# EAGLE design analogBoard (EAGLE 8.4.3)
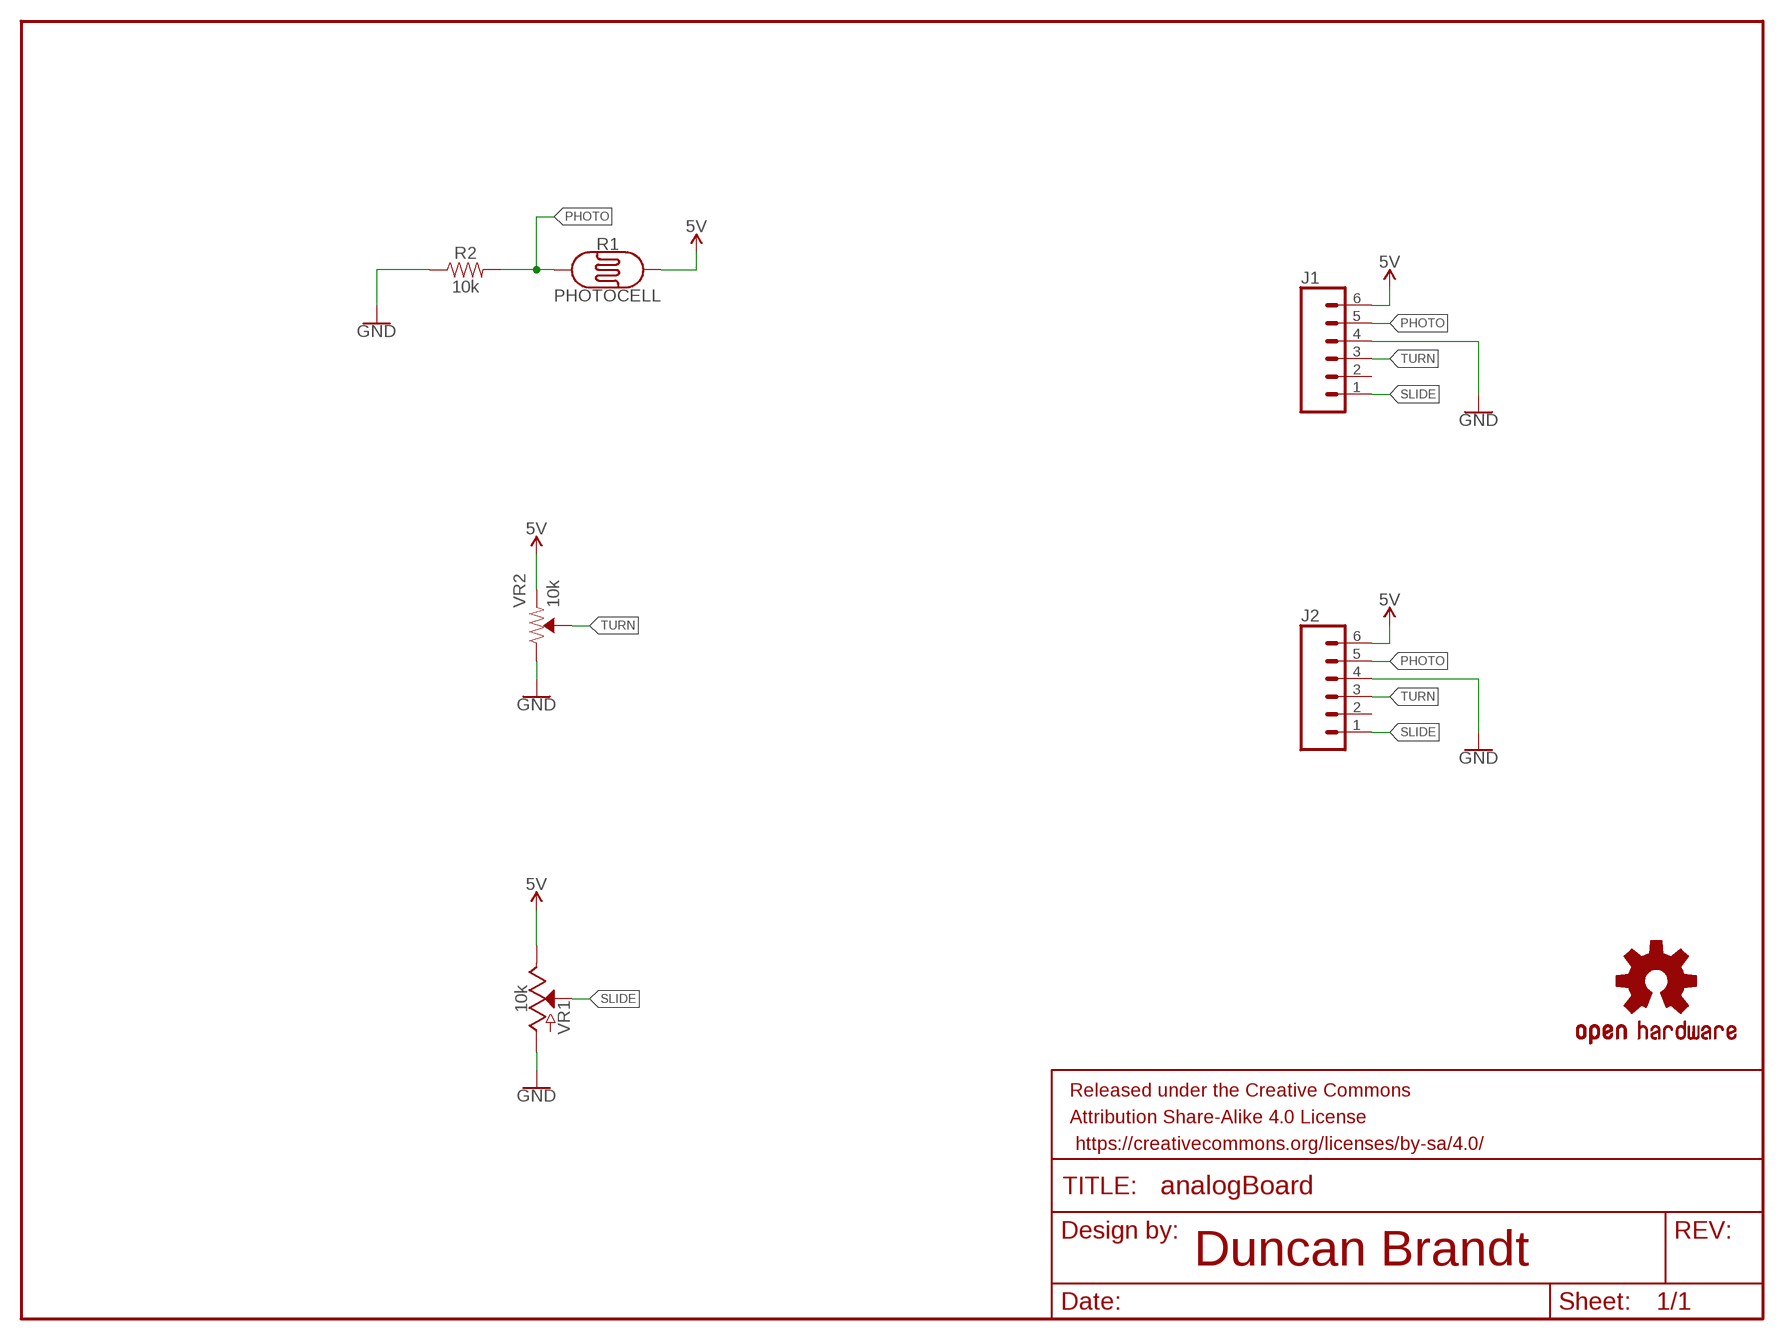
[diagram p0: schematic, sheet 1]

## Parts
FRAME1  FRAME-LETTER  [CREATIVE_COMMONS]
J1  CONN_06SILK_FEMALE_PTH  [1X06]
J2  CONN_06SILK_FEMALE_PTH  [1X06]
LOGO1  OSHW-LOGOL  [OSHW-LOGO-L]
R1  PHOTOCELL  PHOTOCELLPTH  [PHOTOCELL]
R2  10k  10KOHM-0603-1/10W-1%  [0603]
VR1  10k  POTENTIOMETER_SLIDE-20MM-1/10W-20%  [SLIDER-SMALL]
VR2  10k  TRIMPOT-PTH-10MM-KNOB-1/2W-10%  [TRIMPOT-PTH-3386U]

## Nets
5V: J1.6 J2.6 R1.2 VR2.1(CCW)
GND: J1.4 J2.4 R2.1 VR1.BOTTOM(A) VR2.3(CW)
PHOTO: J1.5 J2.5 R1.1 R2.2
SLIDE: J1.1 J2.1 VR1.WIPER(S)
TURN: J1.3 J2.3 VR2.2(WIPER)
VIN: VR1.TOP(E) ; supply symbol labelled 5V
Unconnected: J1.2 J2.2

## Notes on the sheet
- Duncan Brandt

## Library data of the parts
FRAME1 = DB-SYMBOLS:FRAME-LETTER: Schematic Frame - Letter Standard 8.5x11 US Letter frame
J1 J2 = DB-CONN:CONN_06: 6 Pin Header Multi connection point. Often used as Generic Header-pin footprint for 0.1 inch spaced/style header connections DB BOARDS: DB Drawing Board <www.dbboards.com>; PROD_ID: CONN-08437
LOGO1 = DB-SYMBOLS:OSHW-LOGO: Open-Source Hardware (OSHW) Logo This logo indicates the piece of hardware it is found on incorporates a OSHW license and/or adheres to the definition of open source hardware found here: http://freedomdefined.org/OSHW
R1 = DB-RES:PHOTOCELL: Photocell (Photodetector, Photo Resistor, CdS) This is a very small light sensor. A photocell changes resistance depending on the amount of light it is exposed to.
R2 = DB-RES:10KOHM: 10kΩ Resistor Package: 0603 A resistor is a passive two-terminal electrical component that implements electrical resistance as a circuit element. Resistors act to reduce current flow, and, at the same time, act to lower voltage levels within circuits. - Wikipedia DB BOARDS: DB Drawing Board <www.dbboards.com>; PROD_ID: RES-00824
VR1 = DB-RES:POTENTIOMETER_SLIDE: Slide Potentiometer Slide-type potentiometers - pots that are adjusted by sliding a wiper up or down.; PROD_ID: RES-11924; SF_SKU: COM-11620
VR2 = DB-RES:TRIMPOT: Trimming Potentiometer (Trimpot) Three-terminal potentiometers, variable resistor.

## Board
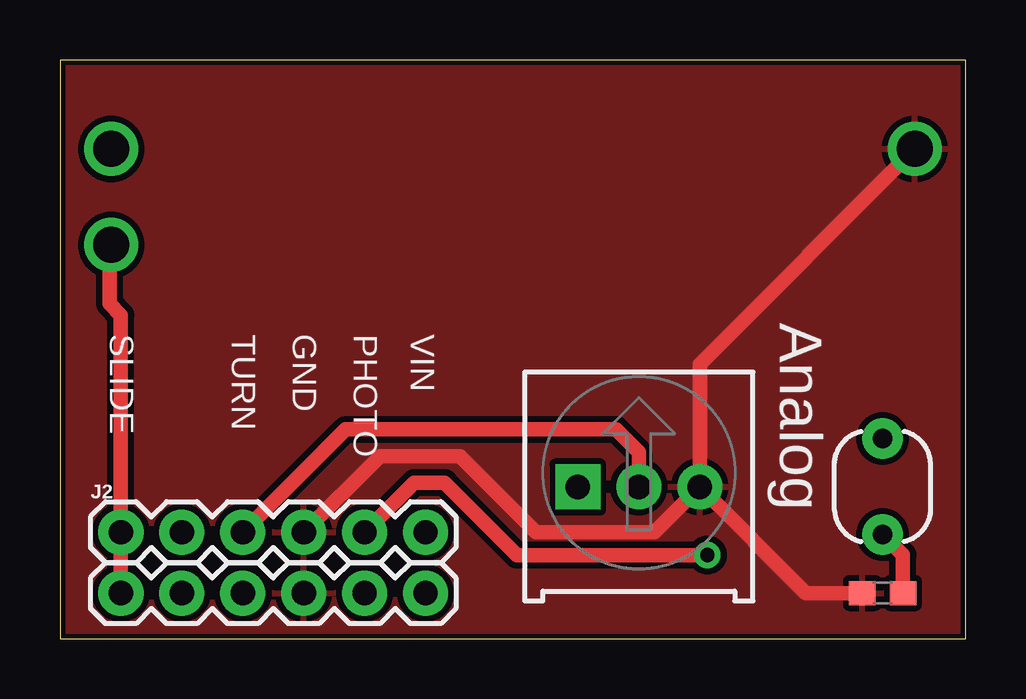
[diagram p1: board, top side]
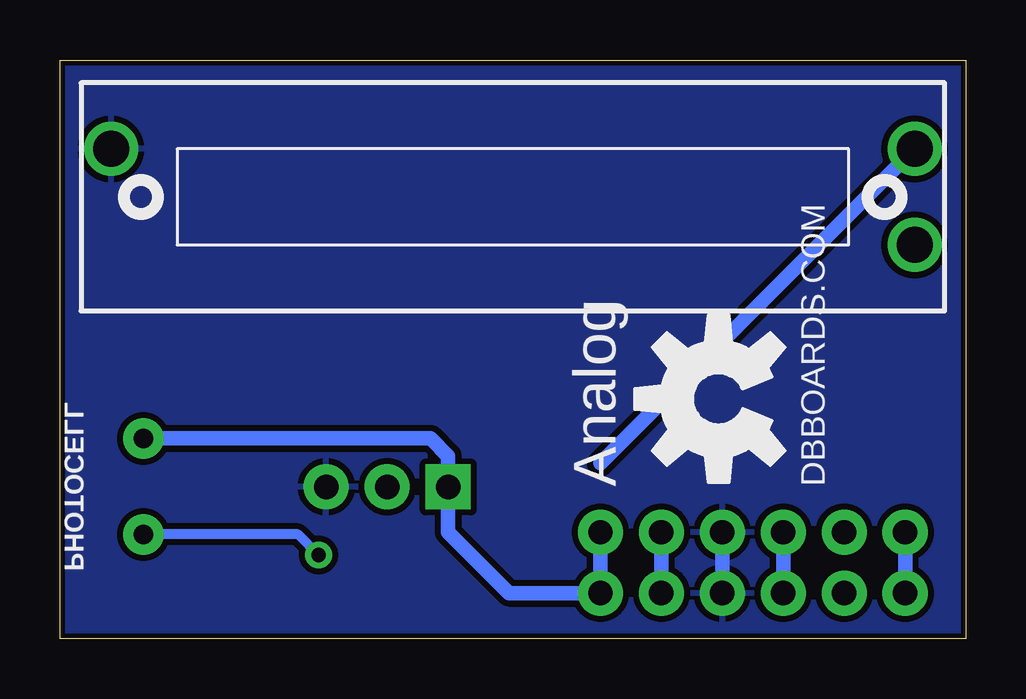
[diagram p2: board, bottom side, seen from below]

Size 37.77 x 24.12 mm. Coordinates in mm from the lower left corner, seen from the top.
Outline: 0,0 37.77,0 37.77,24.12 0,24.12 0,0
Copper layers (1*16): Top 0.035mm / dielectric 1.5mm / Bottom 0.035mm
Design rules "SparkFun-2-layer-STANDARD": minimum track width 10mil, minimum drill 20mil, track to track 10mil, track to pad 8mil, pad to pad 8mil, via to via 10mil, smd to smd 8mil, copper to edge 8mil, drill to drill 8mil, minimum pad ring 10mil, minimum via ring 10mil, stop-mask expansion 4mil, vias tented up to drill 25mil, thermal gap 10mil

### Footprints (pad centres in the part's own frame; a part is rotated, then mirrored left to right if it is on the bottom)
1X06 = drill 1.016 pad 1.88: 1 0,0; 2 2.54,0; 3 5.08,0; 4 7.62,0; 5 10.16,0; 6 12.7,0
PHOTOCELL = drill 0.8 pad 1.676: 1 -2,0; 2 2,0
0603 = smd 1.1 x 1: 1 -0.85,0; 2 0.85,0
SLIDER-SMALL = drill 1.5: BOTTOM 16.75,-2; TOP -16.75,-2; WIPER -16.75,2
TRIMPOT-PTH-3386U = drill 1.016 pad 1.88 square: 1 -2.54,-0.015 | drill 1.016 pad 1.88: 2 0,-0.015; 3 2.54,-0.015

### Placement (x,y rotation side)
FRAME1  -101.6,25.4 0 top  (outside the outline)
J1  2.54,1.91 0 top
J2  2.54,4.45 0 top
LOGO1  10.32,10 90 bottom
R1  34.29,6.35 90 top
R2  34.29,1.91 0 top
VR1  18.89,18.41 180 bottom
VR2  24.13,6.35 0 top

### Tracks (layer width: path | path; a pad name or v marks a point on that pad's centre or on a via)
5V
  Bottom 0.61: R1.2 22.32,8.35 21.59,7.62 VR2.1 21.59,4.45 19.05,1.91 J1.6 J2.6
GND
  Top 0.61: VR2.3 24.78,4.45 19.84,4.45 16.67,7.62 13.34,7.62 J2.4 | VR2.3 31.1,1.91 R2.1 | VR2.3 26.67,11.44 VR1.BOTTOM
  Bottom 0.61: J1.4 J2.4
  pour Bottom: 0,24.13 37.78,24.13 37.78,0 0,0
  pour Top: 0,24.13 37.78,24.13 37.78,0 0,0
PHOTO  (via drill 0.6)
  Top 0.61: R2.2 35.14,3.5 R1.1 | v26.99,3.49 19.05,3.49 16.03,6.51 14.76,6.51 J2.5
  Bottom 0.406: v26.99,3.49 27.84,4.35 R1.1
  Bottom 0.61: J1.5 J2.5
SLIDE
  Top 0.61: VR1.WIPER 2.06,16.34 2.06,13.97 2.54,13.49 J1.1
  Bottom 0.61: J1.1 J2.1
TURN
  Top 0.61: VR2.2 24.13,7.78 23.18,8.73 11.91,8.73 J2.3
  Bottom 0.61: J1.3 J2.3
VIN
  Bottom 0.61: 15.24,7.32 VR1.TOP

### Text on the board
tPlace: SLIDE | TURN | GND | PHOTO | VIN | Analog
bPlace: DBBOARDS.COM | Analog